# Altium schematic sheet M6-Buck_15V.SchDoc
size A4; ApprovedBy: -; CheckedBy: h.t.t.monfared; Author: h.t.t.monfared; Engineer: h.t.t.monfared; Revision: 1.00; SheetNumber: 6; SheetTotal: 10; Project Code:: UFM Sensor Controller; Document Title:: SMPS Buck 15V
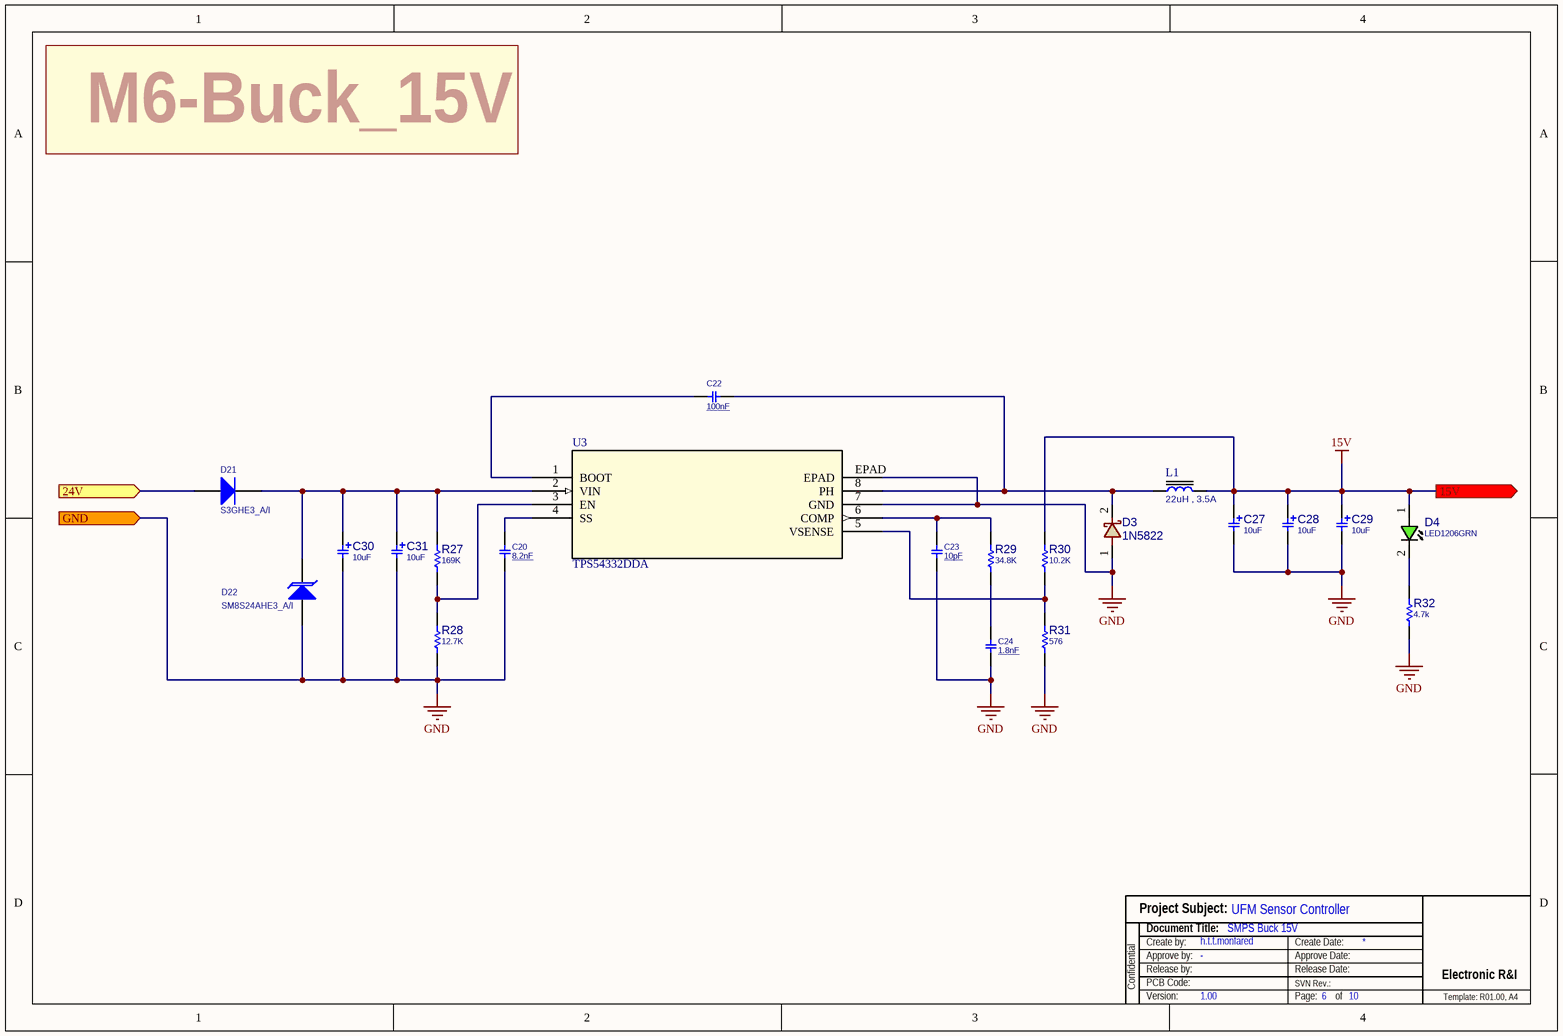
[diagram p0: M6-Buck_15V.SchDoc]

## Parts
C20  8.2nF  [C1206]
C22  100nF  [C1206]
C23  10pF  [C1206]
C24  1.8nF  [C1206]
C27  10uF  [C1206]
C28  10uF  [C1206]
C29  10uF  [C1206]
C30  10uF  [C1206]
C31  10uF  [C1206]
D3  1N5822  [D_AX06_DO27]
D4  LED1206GRN  [LED1206GRN]
D21  S3GHE3_A/I  [DO214AB (SMC)]
D22  SM8S24AHE3_A/I  [DO-218AB]
L1  22uH , 3.5A  [L_12]
R27  169K  [R1206]
R28  12.7K  [R1206]
R29  34.8K  [R1206]
R30  10.2K  [R1206]
R31  576  [R1206]
R32  4.7k  [R1206]
U3  TPS54332DDA  [SO_8T]

## Ports
15V (out), 24V (in), GND (in)

## Nets
15V: C27.1 C28.1 C29.1 D4.1(ANODE) L1.2 R30.2 ; port 15V
GND: C20.1 C23.1 C24.1 C27.2 C28.2 C29.2 C30.2 C31.2 D3.1(A) D22.1(A) R28.1 R31.1 R32.1 U3.7(GND) U3.EPAD ; port GND
24V: D21.1(A) ; port 24V
NetC20_2: C20.2 U3.4(SS)
NetC22_1: C22.1 U3.1(BOOT)
NetC22_2: C22.2 D3.2(K) L1.1 U3.8(PH)
NetC23_2: C23.2 R29.2 U3.6(COMP)
NetC24_2: C24.2 R29.1
NetC30_1: C30.1 C31.1 D21.2(K) D22.2(K) R27.2 U3.2(VIN)
NetD4_2: D4.2(CATHODE) R32.2
NetR27_1: R27.1 R28.2 U3.3(EN)
NetR30_1: R30.1 R31.2 U3.5(VSENSE)

## Notes on the sheet
- M6-Buck_15V
- Project Subject:
- Confidential
- Release by:
- Document Title:
- Create by:
- PCB Code:
- Approve by:
- SVN Rev.:
- Create Date:
- Release Date:
- Approve Date:
- Electronic R&I
- Version:
- Page:
- of
- Template: R01.00, A4

## Library data of the parts
C20 C22-C24 = CAP_SMD_MLCC: CAP, MLCC, 1nF, 50V, C0G, 10%, 0402; MANF_P#: MANF_PART#; MANF: Murata; PARAM: 50V; PRICE: 100= 1$; DESC: CAP, MLCC, 1nF, 50V, C0G, 10%, 0402; PARAM2: C0G, 10%; ASSEMBLY: ASSEMBLY
  C20: VALUE: 8.2nF
  C22: VALUE: 100nF
  C23: VALUE: 10pF
  C24: VALUE: 1.8nF
C27-C31 = CAP_SMD_EL: CAP, THD, ELEC,; MANF_P#: MANF_PART#; PARAM2: 20%; DESC: DESCRIPTION; DIST#: MOUSER; PARAM: 25V; PRICE: 10= 5$; MANF: MANF; ASSEMBLY: ASSEMBLY; VALUE: 10uF
D3 = DIODE_THD_SCHOTTKY_1N5822: DIODE, SCHOTTKY, 40V, 3A; MANF: Diodes; DESC: DESCRIPTION; MANF_P#: 1N5822; ASSEMBLY: ASSEMBLY; PRICE: PRICE; PARAM2: 3A; PARAM: 40V; VALUE: 1N5822
D4 = LED_SMD_1206_GRN: LED, SMD, 1206, GREEN; PARAM: 20mA; DESC: DESCRIPTION; PARAM2: 2.2V; MANF: -; ASSEMBLY: ASSEMBLY; PRICE: 36t@Javan; MANF_P#: -; VALUE: LED1206GRN
D21 = ME04056001: Diode-Rectifier,S,Single,400V,3A,SMC; Manufacturer Code1: 0000101437; Manufacturer Name1: Vishay; Unit Price (USD): Coming Soon; Alternative: Please Add; Description Farsi: SMC,400V,3A,Single,S,دیود یکسوساز; AltCode-1: ALTE433:ACTIVE; AltMat-1: ME04050201; Automotive Qualified: AEC-Q101; Current-Max Reverse Leakage: 10uA; Current-NonrepetitivePeakSurge: 100A; Number of Unit: 1; Packing: TAPE AND REEL; Temperature-Max Operation: 150°C; Temperature-Min Operation: -55°C; Time-Reverse Recovery: 2.5us; Voltage-Max Forward: 1.15V; Material: ME04056001; Function in Circuit: Please Add; Material Class: Diode-Rectifier; ComponentLink1Description: DSH2027395RE: Datasheet-VISHAY; ComponentLink1URL: \\192.168.5.63\eRI_ComponentDatabase\Datasheets\SAP\DSH_2027395_00_1.PDF; ComponentLink2Description: DSH2066440RE: TDT_Infineon; ComponentLink2URL: \\192.168.5.63\eRI_ComponentDatabase\Datasheets\SAP\DSH_2066440_00_1.PDF; Current-Max Forward: 3A; Lead Free: YES; Manufacturer PN1: S3GHE3_A/I; Package/Case: SMC(DO-214AB); RoHS: YES; Temperature-Max Storage: 150°C; Temperature-Min Storage: -55°C; Termination Style (SMD/THT): SMD; Voltage-RepetitivePeakReverse: 400V
D22 = ME04196201: TVS,S,UNI,26.7V,6600W,DO218AB; Manufacturer Name1: Vishay; Manufacturer Code1: 0000101437; Automotive Qualified: AEC-Q101; Packing: TAPE AND REEL; Description Farsi: S,UNI,26.7V,6600W,DO218AB,ديود محافظ; ESD-HBM: Not Mentioned; Current-Max Reverse Leakage: 10uA; Current-Peak Pulse: 170A; Temperature-Max Operation: 175°C; Temperature-Min Operation: -55°C; Type: Unidirectional; Voltage-Clamping: 38.9V; Voltage-Standoff: 24V; Unit Price (USD): Coming Soon; Function in Circuit: Please Add; Material: ME04196201; ComponentLink1URL: \\192.168.5.63\eRI_ComponentDatabase\Datasheets\SAP\DSH_2075710_00_1.PDF; ComponentLink1Description: DSH2075710RE: DSH-PKG_VISHAY; Halogen Free: NA; Lead Free: NA; Manufacturer PN1: SM8S24AHE3_A/I; Package/Case: DO-218AB; RoHS: YES; Termination Style (SMD/THT): SMD; ESD-MM: Not Mentioned; ESD-STD: NOT MENTIONED; Power: 6600W; Voltage-Breakdown: 26.7V; ComponentLink2Description: DSH2079777RE: TDT_ST; ComponentLink2URL: \\192.168.5.63\eRI_ComponentDatabase\Datasheets\SAP\DSH_2079777_00_1.PDF; ComponentLink3Description: DSH2079518RE: TDT_Vishay; ComponentLink3URL: \\192.168.5.63\eRI_ComponentDatabase\Datasheets\SAP\DSH_2079518_00_1.PDF; Alternative: Please Add; Material Class: TVS
L1 = IND_THD: INDUCTOR, THD; VALUE: 22uH , 3.5A
R27-R32 = RES_SMD: RESISTOR, SMD; MANF_P#: RK73H1ETTP4701F; MANF: KOA SPEER; PARAM: 0.063W; DESC: DESCRIPTION; DIST#: MOUSER; PARAM2: 1%; ASSEMBLY: ASSEMBLY; PRICE: 100= 0.5$
  R27: VALUE: 169K
  R28: VALUE: 12.7K
  R29: VALUE: 34.8K
  R30: VALUE: 10.2K
  R31: VALUE: 576
  R32: VALUE: 4.7k
U3 = TPS54332DDA: No Description Available; Mfr_Name: Texas Instruments; Copyright: Copyright (C) 2022 Ultra Librarian. All rights reserved.; Manufacturer_Part_Number: TPS54332DDA; RefDes: RefDes; Type: Type